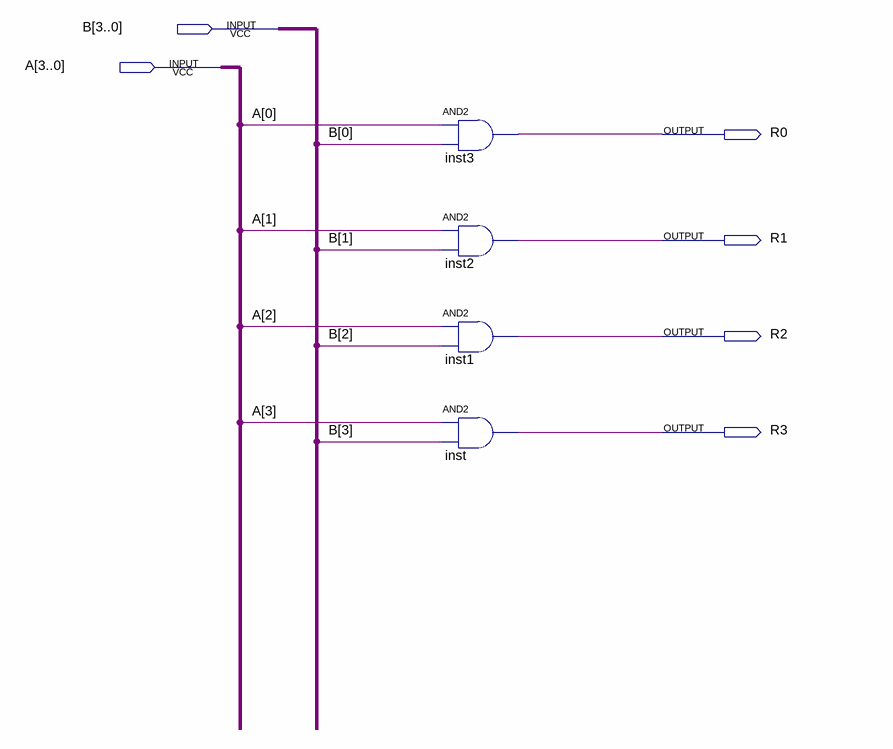
[diagram p0: schematic sheet]
// Quartus schematic ComAnd.bdf as structural Verilog: 4 symbols, 6 pins
module ComAnd (
  input  [3:0] B,
  input  [3:0] A,
  output R0,
  output R1,
  output R2,
  output R3
);

  and inst3 (R0, A[0], B[0]);
  and inst2 (R1, A[1], B[1]);
  and inst1 (R2, A[2], B[2]);
  and inst (R3, A[3], B[3]);
endmodule
